# EAGLE schematic haystack_opto (EAGLE 9.1.0)
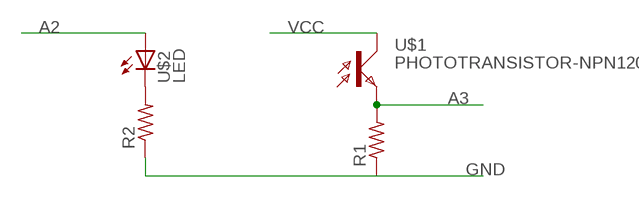
[diagram p0: schematic, sheet 1]

## Parts
R1  RES-US1206  [R1206]
R2  RES-US1206  [R1206]
U$1  PHOTOTRANSISTOR-NPN1206  [OP1206]
U$2  LED  [LED1206]

## Nets
A2: U$2.1(A)
A3: R1.2 U$1.EMITTER(E)
GND: R1.1 R2.1
N$4: R2.2 U$2.2(C)
VCC: U$1.COLLECTOR(C)

## Library data of the parts
R1 R2 = fab :RES-US: Resistor (US Symbol) Variants with postfix FAB are widened to allow the routing of internal traces
U$1 = fab :PHOTOTRANSISTOR-NPN
U$2 = fab :LED: LED